# EAGLE design fa3d_Buck (EAGLE 9.4.2)

## Sheet 1 of 2
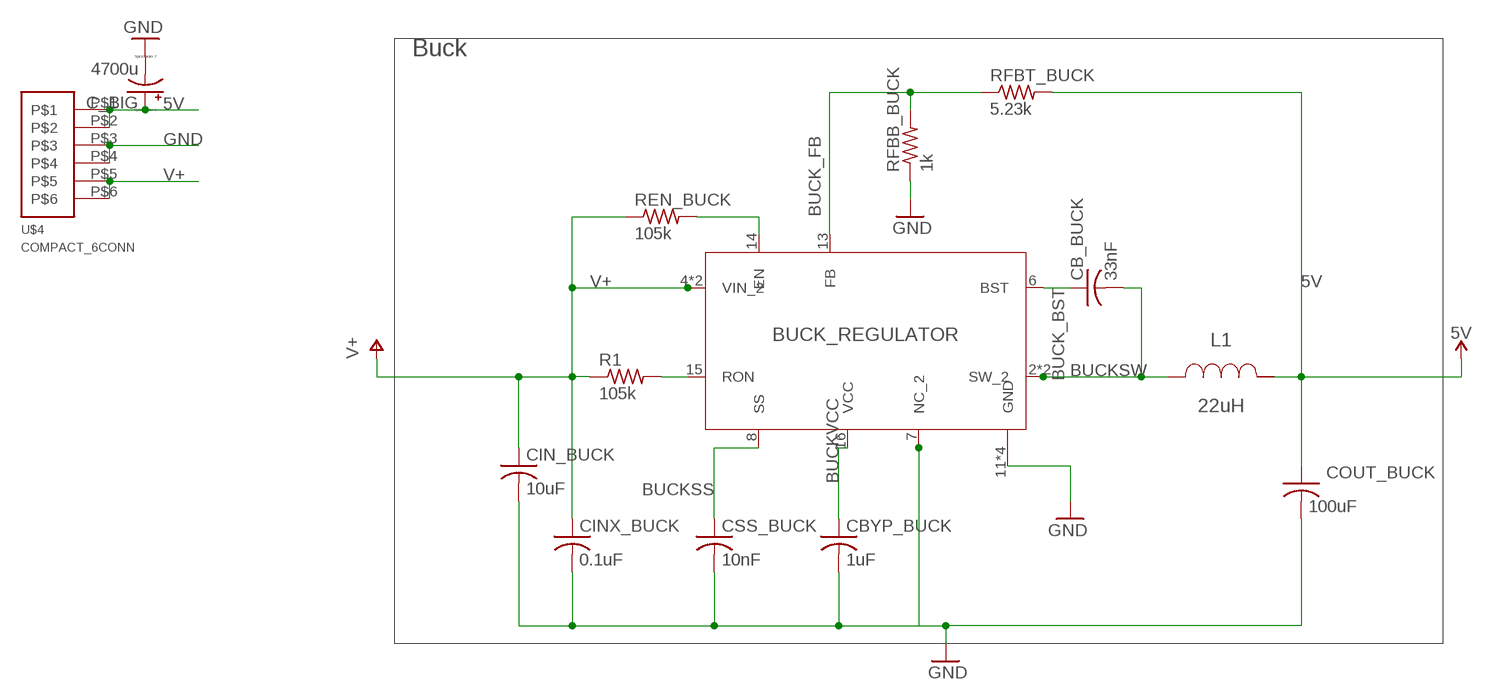
[diagram p0: schematic, sheet 1]

### Parts
BUCK_REGULATOR  BUCK  LM3102MHX/NOPB  [MXA20A]
C_BIG  4700u  CPOL-USTT5D11  [TT5D11]
CB_BUCK  33nF  C-USC0603  [C0603]
CBYP_BUCK  1uF  C-USC0603  [C0603]
CIN_BUCK  10uF  C-USC1206  [C1206]
CINX_BUCK  0.1uF  C-USC0603  [C0603]
COUT_BUCK  100uF  C-USC1206  [C1206]
CSS_BUCK  10nF  C-USC0603  [C0603]
L1  22uH  SDR1307-220ML  [SDR1307]
R1  105k  R-US_R0603  [R0603]
REN_BUCK  105k  R-US_R0603  [R0603]
RFBB_BUCK  1k  R-US_R0603  [R0603]
RFBT_BUCK  5.23k  R-US_R0603  [R0603]
U$4  COMPACT_6CONN  [COMPACT_6CONN]

### Nets
5V: C_BIG.+ COUT_BUCK.1 L1.2 RFBT_BUCK.2 U$4.P$1 U$4.P$2
BUCK_BST: BUCK_REGULATOR.6(BST) CB_BUCK.1
BUCK_FB: BUCK_REGULATOR.13(FB) RFBB_BUCK.2 RFBT_BUCK.1
BUCKEN: BUCK_REGULATOR.14(EN) REN_BUCK.2
BUCKRON: BUCK_REGULATOR.15(RON) R1.2
BUCKSS: BUCK_REGULATOR.8(SS) CSS_BUCK.1
BUCKSW: BUCK_REGULATOR.2(SW_2) BUCK_REGULATOR.3(SW_2) CB_BUCK.2 L1.1
BUCKVCC: BUCK_REGULATOR.16(VCC) CBYP_BUCK.1
GND: BUCK_REGULATOR.7(NC_2) BUCK_REGULATOR.11(GND) BUCK_REGULATOR.17(GND) BUCK_REGULATOR.18(GND) BUCK_REGULATOR.21(GND) C_BIG.- CBYP_BUCK.2 CIN_BUCK.2 CINX_BUCK.2 COUT_BUCK.2 CSS_BUCK.2 RFBB_BUCK.1 U$4.P$3 U$4.P$4
V+: BUCK_REGULATOR.4(VIN_2) BUCK_REGULATOR.5(VIN_2) CIN_BUCK.1 CINX_BUCK.1 R1.1 REN_BUCK.1 U$4.P$5 U$4.P$6

### Notes on the sheet
- Buck

## Sheet 2 of 2

## Library data of the parts
BUCK_REGULATOR = FA3D_lib:LM3102MHX/NOPB; DATASHEETURL: httpwww.ti.comproductlm3102; FREQUENCY: 1000000.0; IMAX: 2.5; MANUFACTURER_NAME: Texas Instruments; MANUFACTURER_PART_NUMBER: LM3102MHXNOPB; MKTG_PACKAGE: NA; NSID: LM3102MHNOPB; PACKAGE: NA; PARTNO: LM3102MH/NOPB; VENDOR: Texas Instruments
C_BIG = resistor:CPOL-US: POLARIZED CAPACITOR, American symbol; PARTNO: UVR0J472MHD
CB_BUCK = resistor:C-US: CAPACITOR, American symbol; PARTNO: 885012206092
CBYP_BUCK = resistor:C-US: CAPACITOR, American symbol; PARTNO: CL10A105KB8NNNC
CIN_BUCK = FA3D_lib:C-US: CAPACITOR, American symbol; PARTNO: GRM188R6YA106MA73D
CINX_BUCK = resistor:C-US: CAPACITOR, American symbol; PARTNO: CL10B104KB8NNNC
COUT_BUCK = resistor:C-US: CAPACITOR, American symbol; PARTNO: CL31A107MQHNNNE
CSS_BUCK = resistor:C-US: CAPACITOR, American symbol; PARTNO: 885012206089
L1 = FA3D_lib:SDR1307-220ML; DCR: 0.047; IDC: 3.6; L: 2.2E5; MANUFACTURER_NAME: Bourns; MANUFACTURER_PART_NUMBER: SDR1307220ML; PARTNO: SDR1307-220ML; VENDOR: Bourns
R1 REN_BUCK = resistor:R-US_: RESISTOR, American symbol; PARTNO: RMCF0603FT105K
RFBB_BUCK = resistor:R-US_: RESISTOR, American symbol; PARTNO: RMCF0603JJ1K00
RFBT_BUCK = resistor:R-US_: RESISTOR, American symbol; PARTNO: RMCF0603FT5K23
U$4 = FA3D_lib:COMPACT_6CONN

## Board
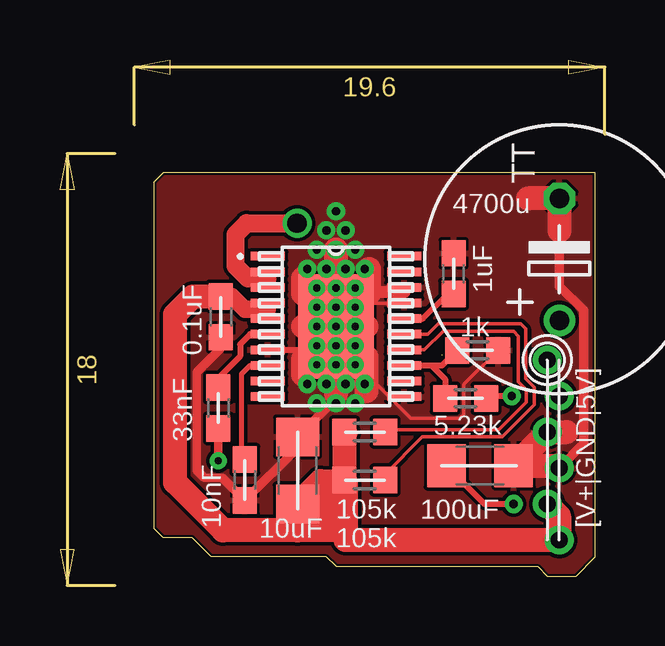
[diagram p1: board, top side]
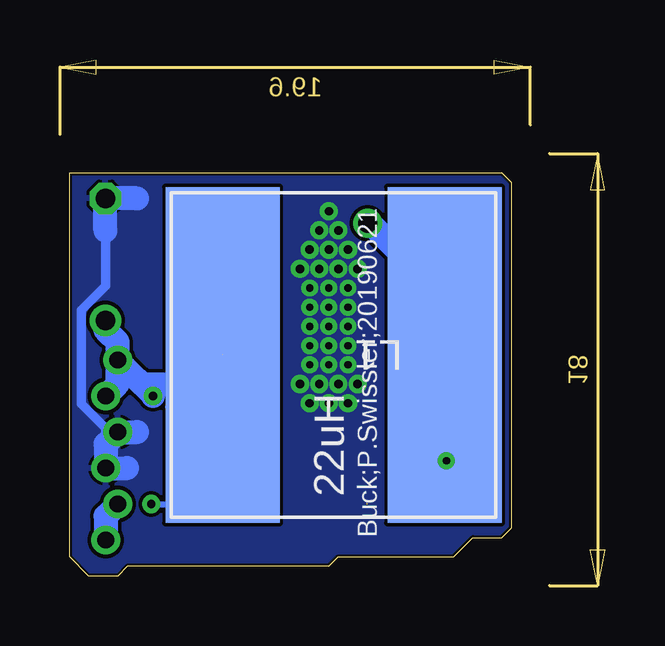
[diagram p2: board, bottom side, seen from below]

Size 18.4 x 16.8 mm. Coordinates in mm from the lower left corner, seen from the top.
Outline: 7.6,0.4 16,0.4 16.4,0 17.6,0 18.4,0.8 18.4,16.8 0.4,16.8 0,16.4 0,2 0.4,1.6 1.6,1.6 2.4,0.8 7.2,0.8 7.6,0.4
Copper layers (1*16): Top 0.035mm / dielectric 1.5mm / Bottom 0.035mm
Design rules "Swissler_Aggressive": minimum track width 0.1mm, minimum drill 0.3mm, track to track 0.15mm, track to pad 0.15mm, pad to pad 0.15mm, via to via 0.15mm, smd to smd 0.1mm, copper to edge 0.1mm, drill to drill 0.1mm, minimum pad ring 10mil, minimum via ring 8mil, stop-mask expansion 4mil, vias tented up to drill 25mil, thermal gap 0.125mm

### Footprints (pad centres in the part's own frame; a part is rotated, then mirrored left to right if it is on the bottom)
MXA20A = smd 1.422 x 0.356: 1 -2.845,2.925; 2 -2.845,2.275; 3 -2.845,1.625; 4 -2.845,0.975; 5 -2.845,0.325; 6 -2.845,-0.325; 7 -2.845,-0.975; 8 -2.845,-1.625; 9 -2.845,-2.275; 10 -2.845,-2.925; 11 2.845,-2.925; 12 2.845,-2.275; 13 2.845,-1.625; 14 2.845,-0.975; 15 2.845,-0.325; 16 2.845,0.325; 17 2.845,0.975; 18 2.845,1.625; 19 2.845,2.275; 20 2.845,2.925 | smd 3.15 x 4.343: 21 0,0
TT5D11 = drill 0.813: + -2.54,0 | drill 0.813 octagon: - 2.54,0
C0603 = smd 1.1 x 1: 1 -0.85,0; 2 0.85,0
C1206 = smd 1.6 x 1.8: 1 -1.4,0; 2 1.4,0
SDR1307 = smd 4.75 x 13.995: 1 -4.623,0; 2 4.623,0
R0603 = smd 1 x 1.1: 1 -0.85,0; 2 0.85,0
COMPACT_6CONN = drill 0.7: P$1 -3,0; P$2 -1.5,0.5; P$3 0,0; P$4 1.5,0.5; P$5 3,0; P$6 4.5,0.5

### Placement (x,y rotation side)
BUCK_REGULATOR  7.6,10.4 0 top
C_BIG  16.91,13.19 90 top
CB_BUCK  2.7,7 270 top
CBYP_BUCK  12.5,12.6 90 top
CIN_BUCK  6,4.4 90 top
CINX_BUCK  2.8,10.8 270 top
COUT_BUCK  13.6,4.6 0 top
CSS_BUCK  3.8,4 270 top
L1  7.4,9.21 180 bottom
R1  8.8,4 0 top
REN_BUCK  8.8,6 0 top
RFBB_BUCK  13.5,9.4 180 top
RFBT_BUCK  13,7.4 0 top
U$4  16.4,6 270 top

### Tracks (layer width: path | path; a pad name or v marks a point on that pad's centre or on a via)
5V  (via drill 0.35)  (1 unrouted)
  Top 0.25: RFBT_BUCK.2 13.95,7.5 v14.92,7.5 | v15,3 13.8,3 COUT_BUCK.1
  Bottom 0.152: 11.84,9.39 L1.2
  Bottom 0.25: 11.84,9.39 11.84,8.8 11.94,8.7 11.94,3.66 12.6,3 v15,3
  Bottom 0.5: L1.2 14.18,7.05 | 12.42,8.82 L1.2
  Bottom 1: 11.84,5.36 11.84,8 | 11.84,8 11.84,8.8 | U$4.P$1 15.4,8 11.84,8 | U$4.P$2 16.4,8 U$4.P$1 | U$4.P$1 16.4,9.74 16.91,10.25 C_BIG.+ | U$4.P$1 14.92,7.52 v14.92,7.5
BUCK_BST
  Top 0.25: BUCK_REGULATOR.6 4.02,10.07 3.6,9.65 3.6,9.15 2.7,8.25 CB_BUCK.1
BUCK_FB
  Top 0.25: RFBT_BUCK.1 12.15,8.2 11.57,8.78 BUCK_REGULATOR.13 12.02,8.78 RFBB_BUCK.2
BUCKEN
  Top 0.152: 10.5,9.37 BUCK_REGULATOR.14 11.29,9.42 12.06,10.2 15,10.2 15.2,10 15.2,8.09 15.53,7.76 15.53,7.24 14.39,6.1 9.75,6.1 REN_BUCK.2
BUCKRON
  Top 0.152: BUCK_REGULATOR.15 11.42,10.07 11.86,10.51 15.3,10.51 15.5,10.3 15.5,8.22 15.87,7.86 15.87,7.14 14.52,5.79 11.2,5.79 9.65,4.24 R1.2
BUCKSS
  Top 0.152: CSS_BUCK.1 3.67,4.98
  Top 0.2: 3.67,4.98 3.67,8.42 4.02,8.78 BUCK_REGULATOR.8
BUCKSW  (via drill 0.3, 0.8)
  Top 0.152: BUCK_REGULATOR.2 4.75,12.4 BUCK_REGULATOR.3 | 2.67,6.12 CB_BUCK.2
  Top 0.35: 2.67,6.12 2.7,6.1 v2.7,4.8
  Top 0.75: v5.98,14.7 3.88,14.7 3.42,14.24 3.42,12.91 3.93,12.4 4.75,12.4
  Bottom 0.152: v2.7,4.8 2.7,9.13 L1.1
  Bottom 1: v5.98,14.7 5.87,14.7 2.78,11.61 L1.1
BUCKVCC
  Top 0.25: BUCK_REGULATOR.16 11.22,10.72 12.25,11.75 CBYP_BUCK.1
GND  (via drill 0.3, 0.35)
  Top 0.152: BUCK_REGULATOR.18 BUCK_REGULATOR.17 8.57,11.38 8.2,11 | BUCK_REGULATOR.21 6.6,9.4 | 7.6,8.4 8.88,8.4 10.71,6.57 12.77,6.57 12.93,6.73 12.93,7.98 RFBB_BUCK.1
  Top 0.25: 6.31,9.2 6.08,9.42 BUCK_REGULATOR.7
  Top 0.35: CINX_BUCK.2 2.8,9.49 1.8,8.49 1.8,4.41 2.11,4.1 2.85,4.1 CSS_BUCK.2 6,5.35 CIN_BUCK.2 7.6,7.4 v7.6,9.6
  Top 0.4: C_BIG.- 16.91,12.08 17.92,11.07 17.92,5.52 U$4.P$4
  Top 0.5: 10.44,11.82 9.02,11.82 8.2,11
  Top 1: U$4.P$4 16.8,4.6 COUT_BUCK.2 U$4.P$3 17.2,6 | 16.91,14.4 C_BIG.- 15.6,15.73 | BUCK_REGULATOR.21 v7.6,9.6 7.6,8.4 7.6,7.6 | 6.6,9.4 6.22,9.02 6.22,8.4 | BUCK_REGULATOR.21 8.88,9.12 8.88,7.7 | BUCK_REGULATOR.21 7.6,12.8 | BUCK_REGULATOR.21 6.22,11.78 6.22,12.4 | BUCK_REGULATOR.21 8.2,11 8.98,11.78 8.98,12.8 | BUCK_REGULATOR.21 v7.6,13.6 | BUCK_REGULATOR.21 6.22,10.4 | 8.88,10.4 BUCK_REGULATOR.21
  Bottom 0.4: C_BIG.- 16.9,12.09 17.92,11.07 17.92,7.17 16.9,6.15 U$4.P$4
  Bottom 1: 16,4.5 U$4.P$4 16.9,5.5 U$4.P$3 15.6,6 | 15.6,15.73 C_BIG.- 16.91,14.4
  other vias: 7.6,10.4 6.8,12 7.6,12 8.4,12 6.8,11.2 7.6,11.2 8.4,11.2 8.4,10.4 6.8,10.4 6.8,9.6 8.4,9.6 8.4,8.8 6.8,8.8 7.6,8.8 6.8,7.2 6.4,8 7.2,8 8,8 8.8,8 7.6,7.2 8.4,7.2 8.8,12.8 8,12.8 7.2,12.8 6.4,12.8 6.8,13.6 8.4,13.6 7.2,14.4 8,14.4 7.6,15.2
  pour Top: -1.2,-1.2 -1.2,81.2 76,81.2 76,1.2 74,-0.8 -0.8,-0.8
  pour Bottom: -5.6,-3.2 -5.6,50.8 8.4,64.8 86.8,64.8 92,59.6 92,-12.8 4.4,-12.8 -5.2,-3.2
V+  (1 unrouted)
  Top 0.152: CIN_BUCK.1 7.8,3 8,2.8
  Top 0.25: 2.62,11.38 BUCK_REGULATOR.4 4.75,11.1 BUCK_REGULATOR.5
  Top 0.7: CINX_BUCK.1 3.26,11.65 3.81,11.1 4.75,11.1
  Top 1: 6.4,3.08 6,3.08 | 8,5.95 REN_BUCK.1 R1.1 | 2.7,11.65 CINX_BUCK.1 1.65,11.65 0.9,10.9 0.9,3.9 2.9,1.9 6,1.9 | U$4.P$5 16.9,2.5 U$4.P$6 8,1.5 8,1.9 | 8,1.9 6,1.9 | R1.1 8,3.95 | 8,3.95 8,2.8 8,1.9 | CIN_BUCK.1 6,1.9 | CIN_BUCK.1 6.95,3.95 8,3.95 | CIN_BUCK.1 6.9,3 | 6.9,3 8,1.9 | R1.1 6.95,3 6.9,3
  Bottom 1: U$4.P$5 16.9,2.5 U$4.P$6

### Text on the board
tPlace: [V+|GND|5V]
bPlace: Buck;P.Swissler;20190621